# EAGLE design PoE (EAGLE 9.5.2)
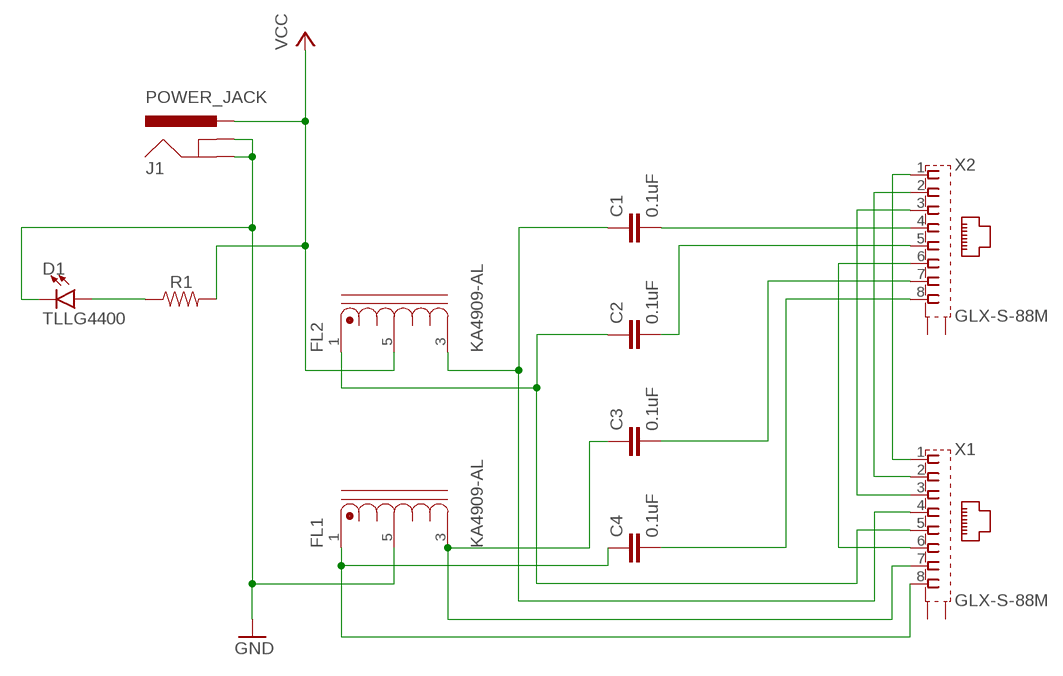
[diagram p0: schematic, sheet 1]

## Parts
C1  0.1uF  0.1UF-KIT-EZ-50V-20%  [CAP-PTH-SMALL-KIT]
C2  0.1uF  0.1UF-KIT-EZ-50V-20%  [CAP-PTH-SMALL-KIT]
C3  0.1uF  0.1UF-KIT-EZ-50V-20%  [CAP-PTH-SMALL-KIT]
C4  0.1uF  0.1UF-KIT-EZ-50V-20%  [CAP-PTH-SMALL-KIT]
D1  TLLG4400  LED3MM  [LED_3MM]
FL1  KA4909-AL  [FIL_KA4909-AL]
FL2  KA4909-AL  [FIL_KA4909-AL]
J1  POWER_JACK  [POWER_JACK_PTH]
R1  RESISTORAXIAL-0.3  [AXIAL-0.3]
X1  GLX-S-88M  [GLX-S-88M]
X2  GLX-S-88M  [GLX-S-88M]

## Nets
GND: D1.K(C) FL1.5 J1.GND J1.GNDBREAK
N$1: D1.A R1.P$1
N$2: X1.1 X2.1
N$3: X1.2 X2.2
N$4: X1.3 X2.3
N$5: X1.6 X2.6
N$6: C1.2 X2.4
N$7: C2.2 X2.5
N$8: C3.2 X2.7
N$9: C4.2 X2.8
N$10: C1.1 FL2.3 X1.4
N$11: C2.1 FL2.1 X1.5
N$14: C4.1 FL1.1 X1.8
N$15: C3.1 FL1.3 X1.7
VCC: FL2.5 J1.PWR R1.P$2
Unconnected: X1.S1 X1.S2 X2.S1 X2.S2

## Library data of the parts
C1-C4 = SparkFun-Capacitors:0.1UF: 0.1µF ceramic capacitors A capacitor is a passive two-terminal electrical component used to store electrical energy temporarily in an electric field.; PROD_ID: CAP-08370
D1 = SparkFun-LED:LED: LED (Generic) Standard schematic elements and footprints for 5mm, 3mm, 1206, and 0603 sized LEDs. Generic LEDs with no color specified.; PROD_ID: DIO-08794
FL1 FL2 = KA4909-AL:KA4909-AL: Bias Injection Choke; AVAILABILITY: Unavailable; DESCRIPTION: Bias Injection Choke; MF: Coilcraft; MP: KA4909-AL; PACKAGE: Package Analog Devices; PRICE: None
J1 = SparkFun-Connectors:POWER_JACK: Power Jack Connector This is the standard 5.5mm barrel jack for power. The PTH is the most common, proven, reliable, footprint. The Slot footprint only works if the mill layer is transmitted to the PCB fab house so be warned. Here are the connectors we sell at SparkFun: DC Barrel Power Jack/Connector <https://www.sparkfun.com/products/119> (PRT-00119) DC Barrel Power Jack/Connector (SMD) <https://www.sparkfun.com/products/12748> (PRT-12748) DC Barrel Jack Adapter - Breadboard Compatible <https://www.sparkfun.com/products/10811> (PRT-10811) It is used on this SparkFun product (and many, many others): SparkFun RedBoard - Programmed with Arduino <https://www.sparkfun.com/products/12757> (DEV-12757) Also, if you need a mating power supply or connector, please check these out: Wall Adapter Power Supply - 9VDC 650mA <https://www.sparkfun.com/products/298> (TOL-00298) DC Barrel Jack Adapter - Male <https://www.sparkfun.com/products/10287> (PRT-10287); PROD_ID: CONN-08197
R1 = SparkFun-Resistors:RESISTOR: Generic Resistor Package
X1 X2 = con-kycon:GLX-S-88M: Mod. Jack, Right Angle, 8 posiotion, 8 contatcs RJ45 Source: GLX-S-88M.pdf; OC_FARNELL: unknown; OC_NEWARK: unknown

## Board
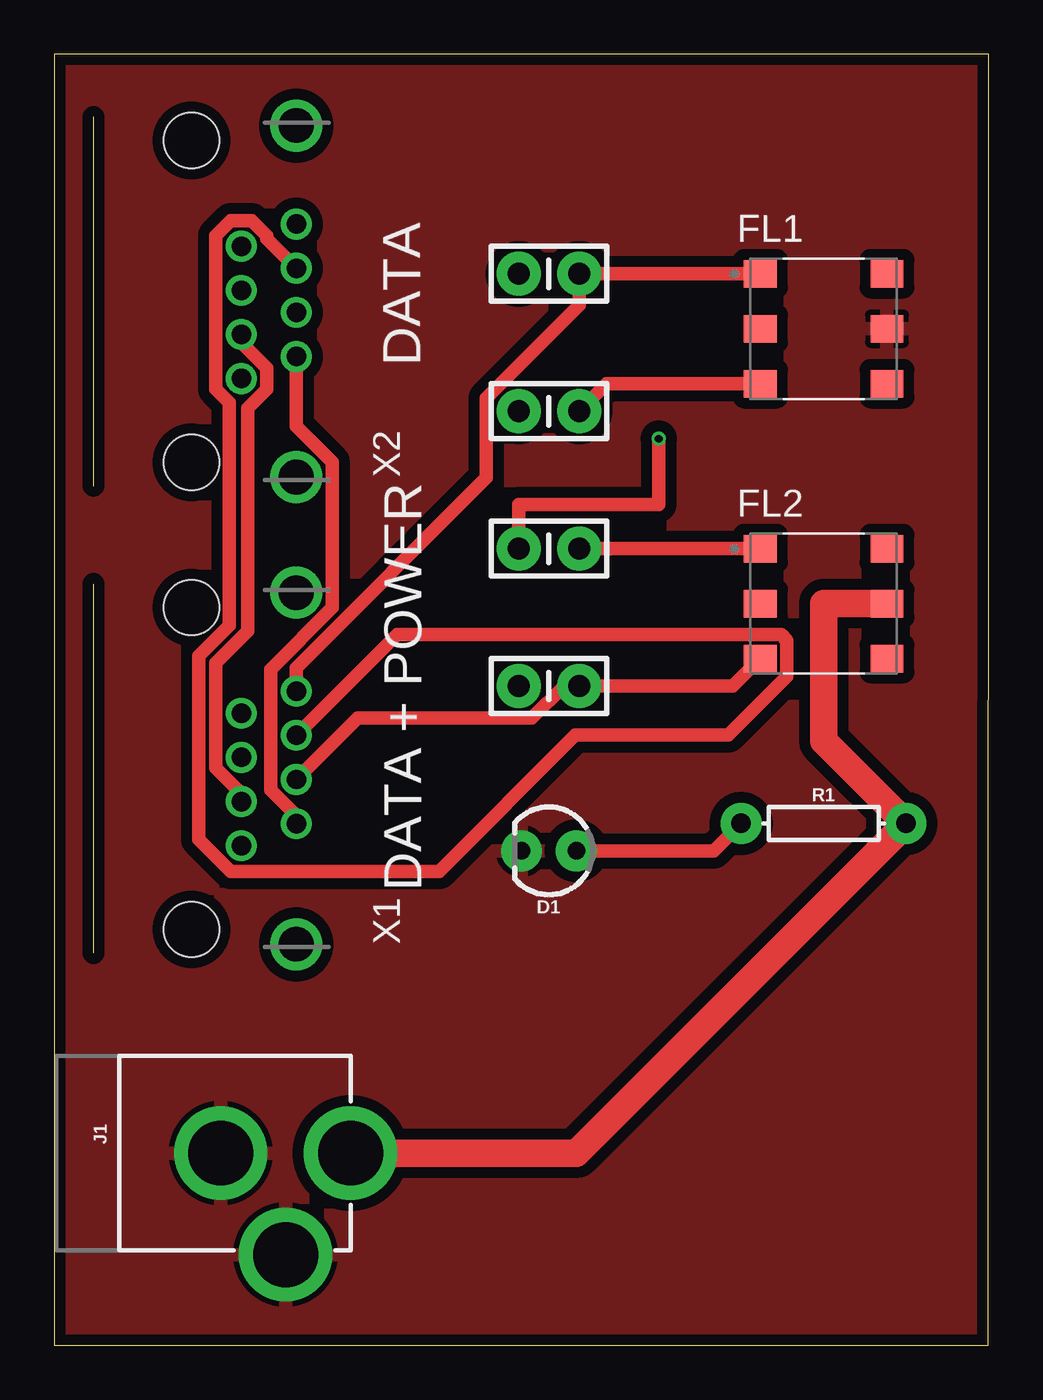
[diagram p1: board, top side]
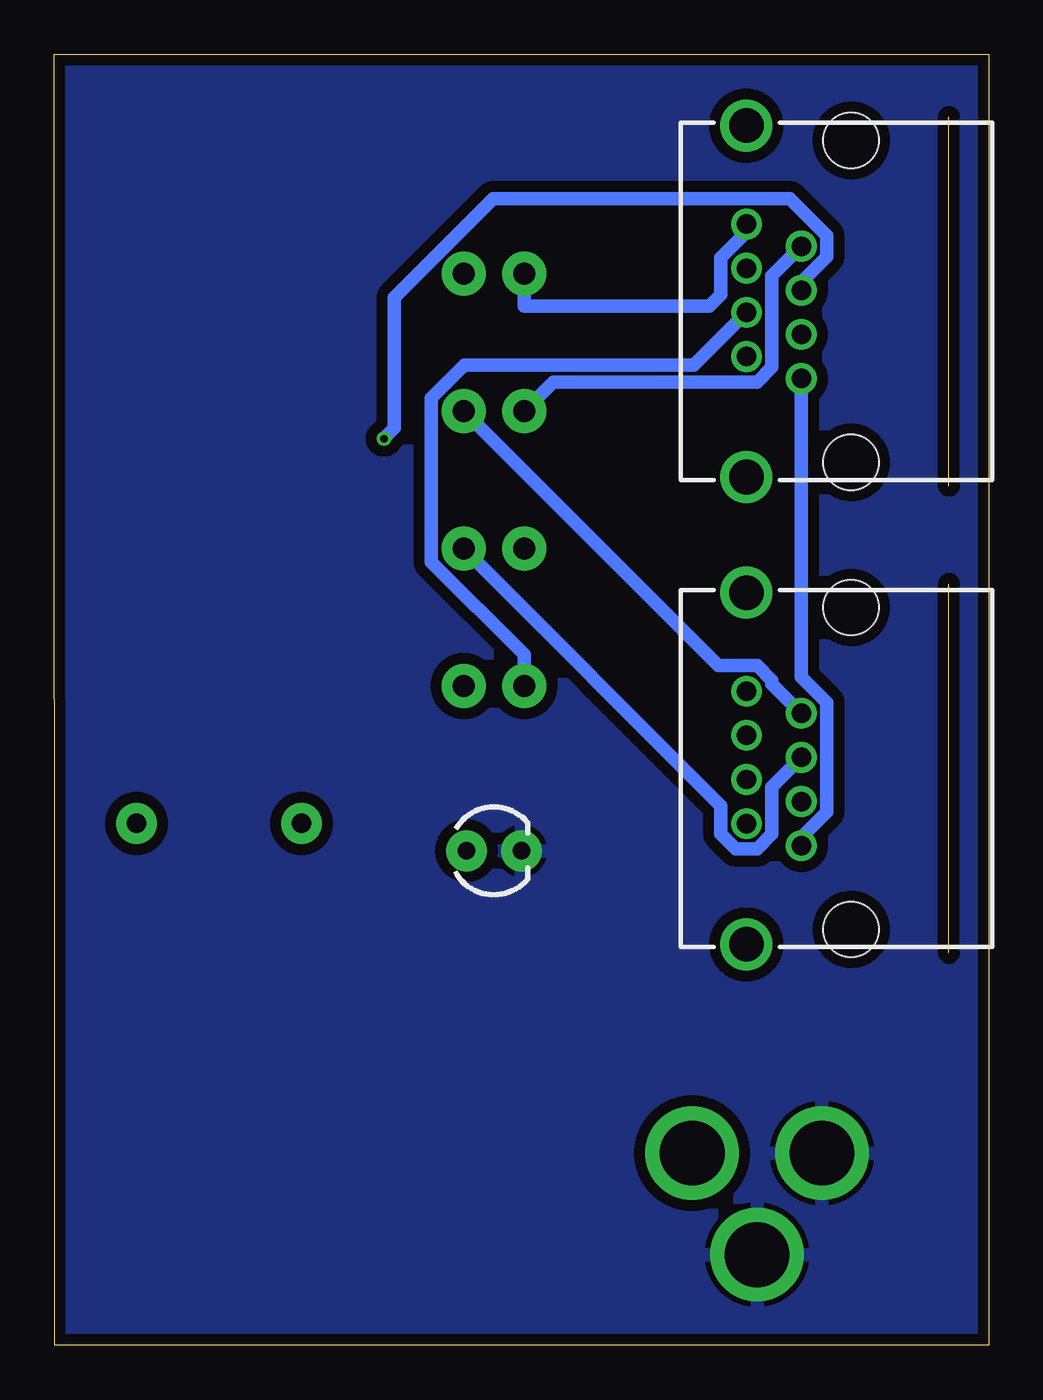
[diagram p2: board, bottom side, seen from below]

Size 43.18 x 59.69 mm. Coordinates in mm from the lower left corner, seen from the top.
Outline: 0,0 43.16,0 43.18,59.69 0,59.69 0,0
Copper layers (1*16): Top 0.035mm / dielectric 1.5mm / Bottom 0.035mm
Design rules "SparkFun-2-layer-PCBWay-LIMIT": minimum track width 6mil, minimum drill 0.3mm, track to track 6mil, track to pad 6mil, pad to pad 6mil, via to via 6mil, smd to smd 6mil, copper to edge 6mil, drill to drill 6mil, minimum pad ring 6mil, minimum via ring 6mil, stop-mask expansion 4mil, vias tented up to drill 25mil, thermal gap 10mil

### Footprints (pad centres in the part's own frame; a part is rotated, then mirrored left to right if it is on the bottom)
CAP-PTH-SMALL-KIT = drill 1.016 pad 2.032: 1 -1.397,0; 2 1.397,0
LED_3MM = drill 0.813 pad 1.88: A -1.27,0; K 1.27,0
FIL_KA4909-AL = smd 1.52 x 1.27: 1 -2.925,2.54; 2 -2.925,0; 3 -2.925,-2.54; 4 2.925,-2.54; 5 2.925,0; 6 2.925,2.54
POWER_JACK_PTH = drill 2.997 pad 4.318: GND 0,7.7; GNDBREAK 4.7,10.7; PWR 0,13.7
AXIAL-0.3 = drill 0.9 pad 1.88: P$1 -3.81,0; P$2 3.81,0
GLX-S-88M = drill 0.9 pad 1.422: 1 -3.57,-2.3; 2 -2.55,-4.84; 3 -1.53,-2.3; 4 -0.51,-4.84; 5 0.51,-2.3; 6 1.53,-4.84; 7 2.55,-2.3; 8 3.57,-4.84 | drill 1.6 pad 2.184: S1 -8.125,-4.84; S2 8.125,-4.84 | hole 2.55: -7.44,0; 7.44,0

### Placement (x,y rotation side)
C1  22.86,30.48 180 top
C2  22.86,36.83 180 top
C3  22.86,43.18 180 top
C4  22.86,49.53 180 top
D1  22.86,22.86 180 top
FL1  35.56,46.99 0 top
FL2  35.56,34.29 0 top
J1  0,8.89 270 top
R1  35.56,24.13 0 top
X1  6.35,26.67 90 top
X2  6.35,48.26 90 top

### Tracks (layer width: path | path; a pad name or v marks a point on that pad's centre or on a via)
GND
  pour Top (isolate 0.508): 0,59.69 43.18,59.69 43.18,0 0,0
  pour Bottom (isolate 0.508): 0,59.69 43.18,59.69 43.18,0 0,0
N$1
  Top 0.635: R1.P$1 30.48,22.86 D1.A
N$2
  Bottom 0.635: X1.1 8.65,23.47 7.47,24.65 7.47,29.71 8.65,30.89 X2.1
N$3
  Top 0.635: X1.2 11.19,24.49 10.01,25.67 10.01,31.25 12.86,34.1 12.86,40.83 11.19,42.5 X2.2
N$4
  Top 0.635: X1.3 8.65,25.51 7.47,26.69 7.47,31.54 8.96,33.03 8.96,43.33 9.83,44.2 9.83,45.18 8.65,46.36 X2.3
N$5
  Top 0.635: X2.6 9.83,51.15 9.83,51.3 9.14,51.99 8.16,51.99 7.47,51.3 7.47,44.2 8.1,43.58 8.1,33.28 6.68,31.87 6.68,23.4 8.16,21.92 17.8,21.92 24.09,28.21 31.15,28.21 33.87,30.92 33.87,32.58 33.59,32.86 15.85,32.86 X1.6
N$6
  Bottom 0.635: C1.2 21.46,31.93 25.74,36.22 25.74,43.8 24.22,45.32 13.62,45.32 X2.4
N$7  (via drill 0.35)
  Top 0.635: v27.94,41.91 27.94,38.86 21.46,38.86 C2.2
  Bottom 0.635: v27.94,41.91 27.46,42.39 27.46,48.43 22.88,53.01 9.18,53.01 7.47,51.3 7.47,50.32 8.65,49.14 X2.5
N$8
  Bottom 0.635: C3.2 20.11,44.53 10.7,44.53 10.01,45.22 10.01,49.45 X2.7
N$9
  Bottom 0.635: X2.8 11.19,51.46 12.37,50.28 12.37,48.56 12.9,48.03 21.46,48.03 C4.2
N$10
  Top 0.635: FL2.3 31.36,30.48 C1.1 23.56,30.48 22.08,28.99 14.02,28.99 X1.4
N$11
  Top 0.635: FL2.1 C2.1
  Bottom 0.635: X1.5 10.01,25.82 10.01,23.63 10.7,22.94 11.68,22.94 12.37,23.63 12.37,24.94 C2.1
N$14
  Top 0.635: FL1.1 C4.1 24.26,48.08 19.98,43.8 19.98,40.11 11.19,31.32 X1.8
N$15
  Top 0.635: FL1.3 25.53,44.45 C3.1
  Bottom 0.635: X1.7 10.01,30.58 10.01,30.73 10.7,31.42 12.5,31.42 C3.1
VCC
  Top 1.27: J1.PWR 24.13,8.89 R1.P$2 35.56,27.94 35.56,34.29 FL2.5

### Text on the board
tNames: DATA | DATA + POWER
Document: Passive Gigabit PoE | PINS 4,5 9-50VDC / PINS 7,8 RETURN / 1A MAX